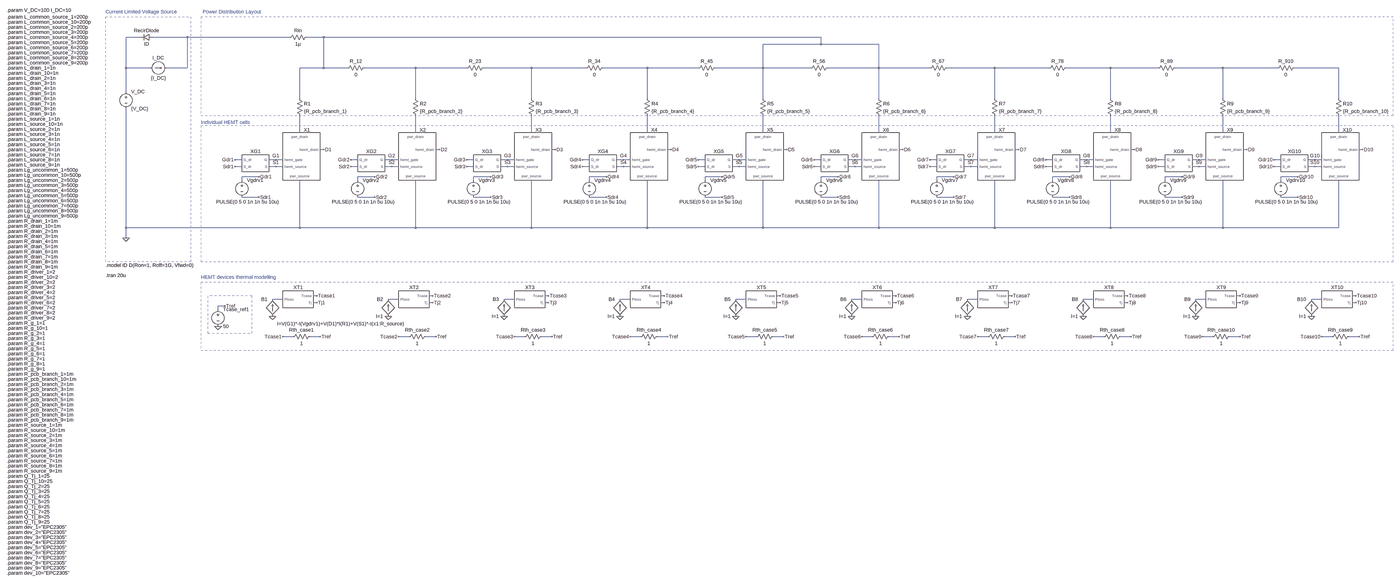
[diagram p0: schematic ParGan_V4.asc, whole sheet]
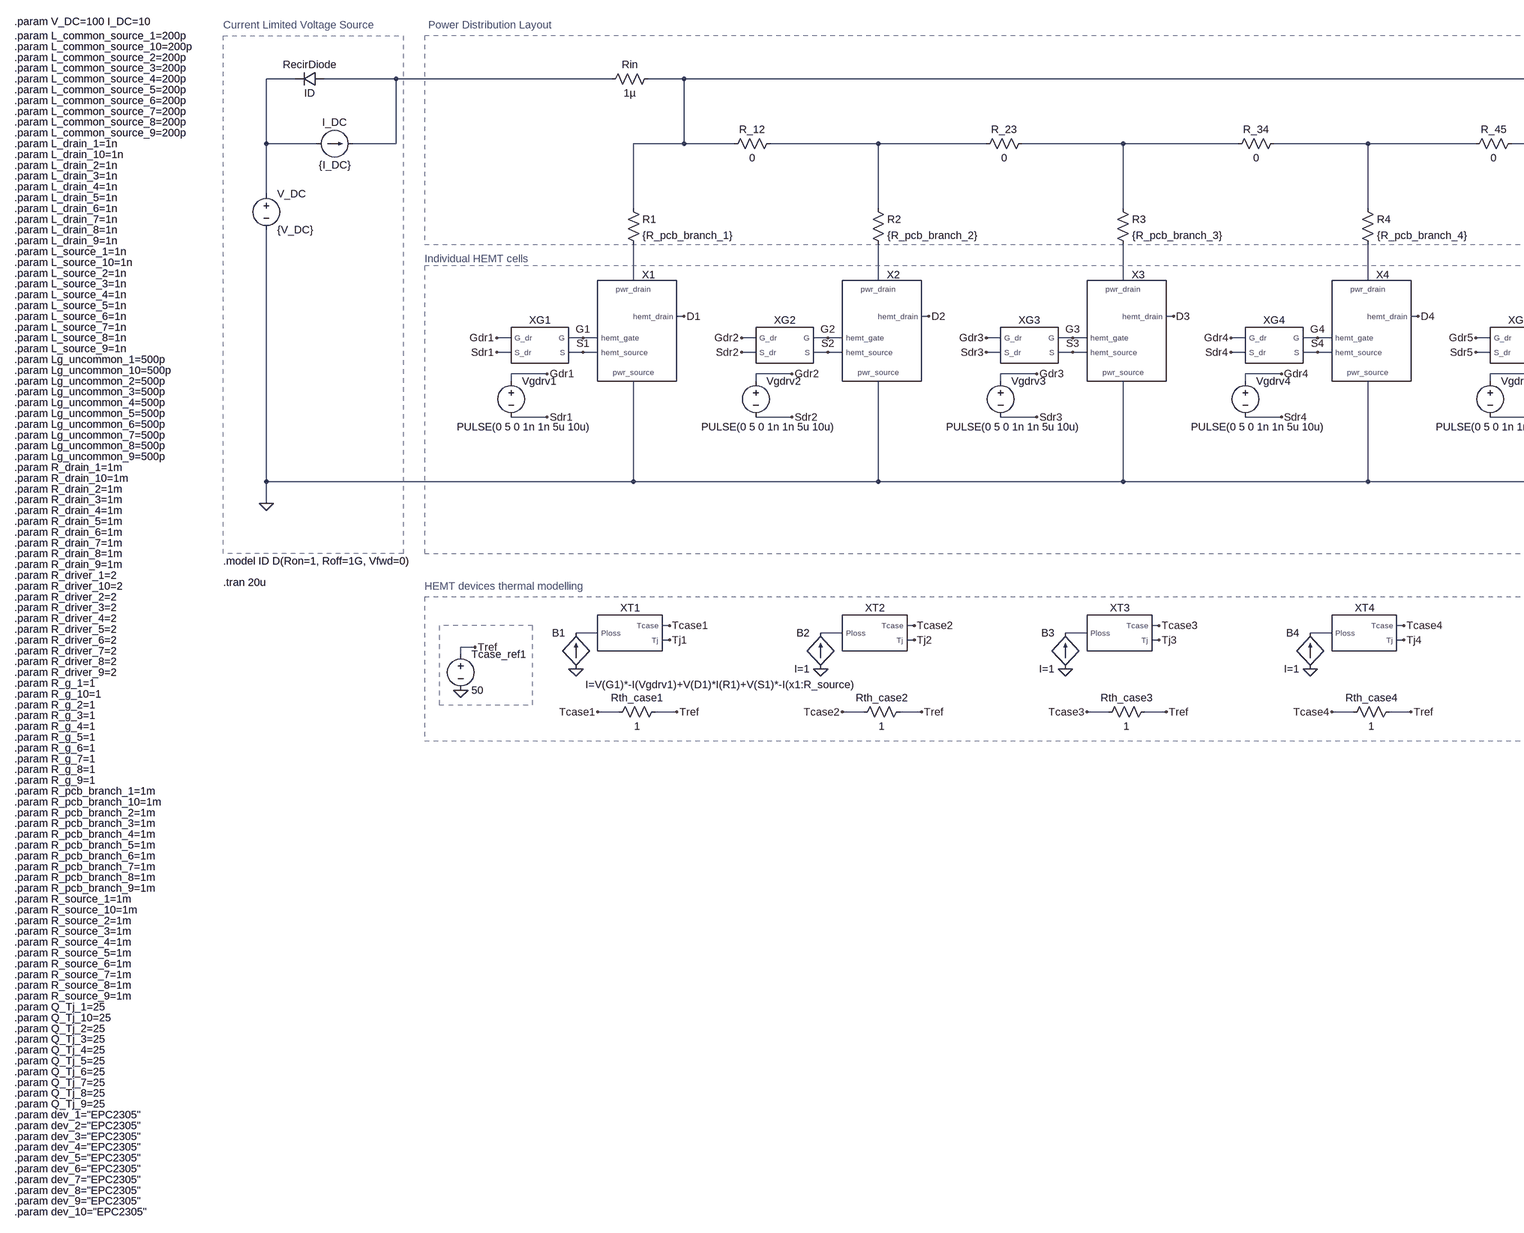
[diagram p1: schematic ParGan_V4.asc, part, row 1 of 1, column 1 of 2]
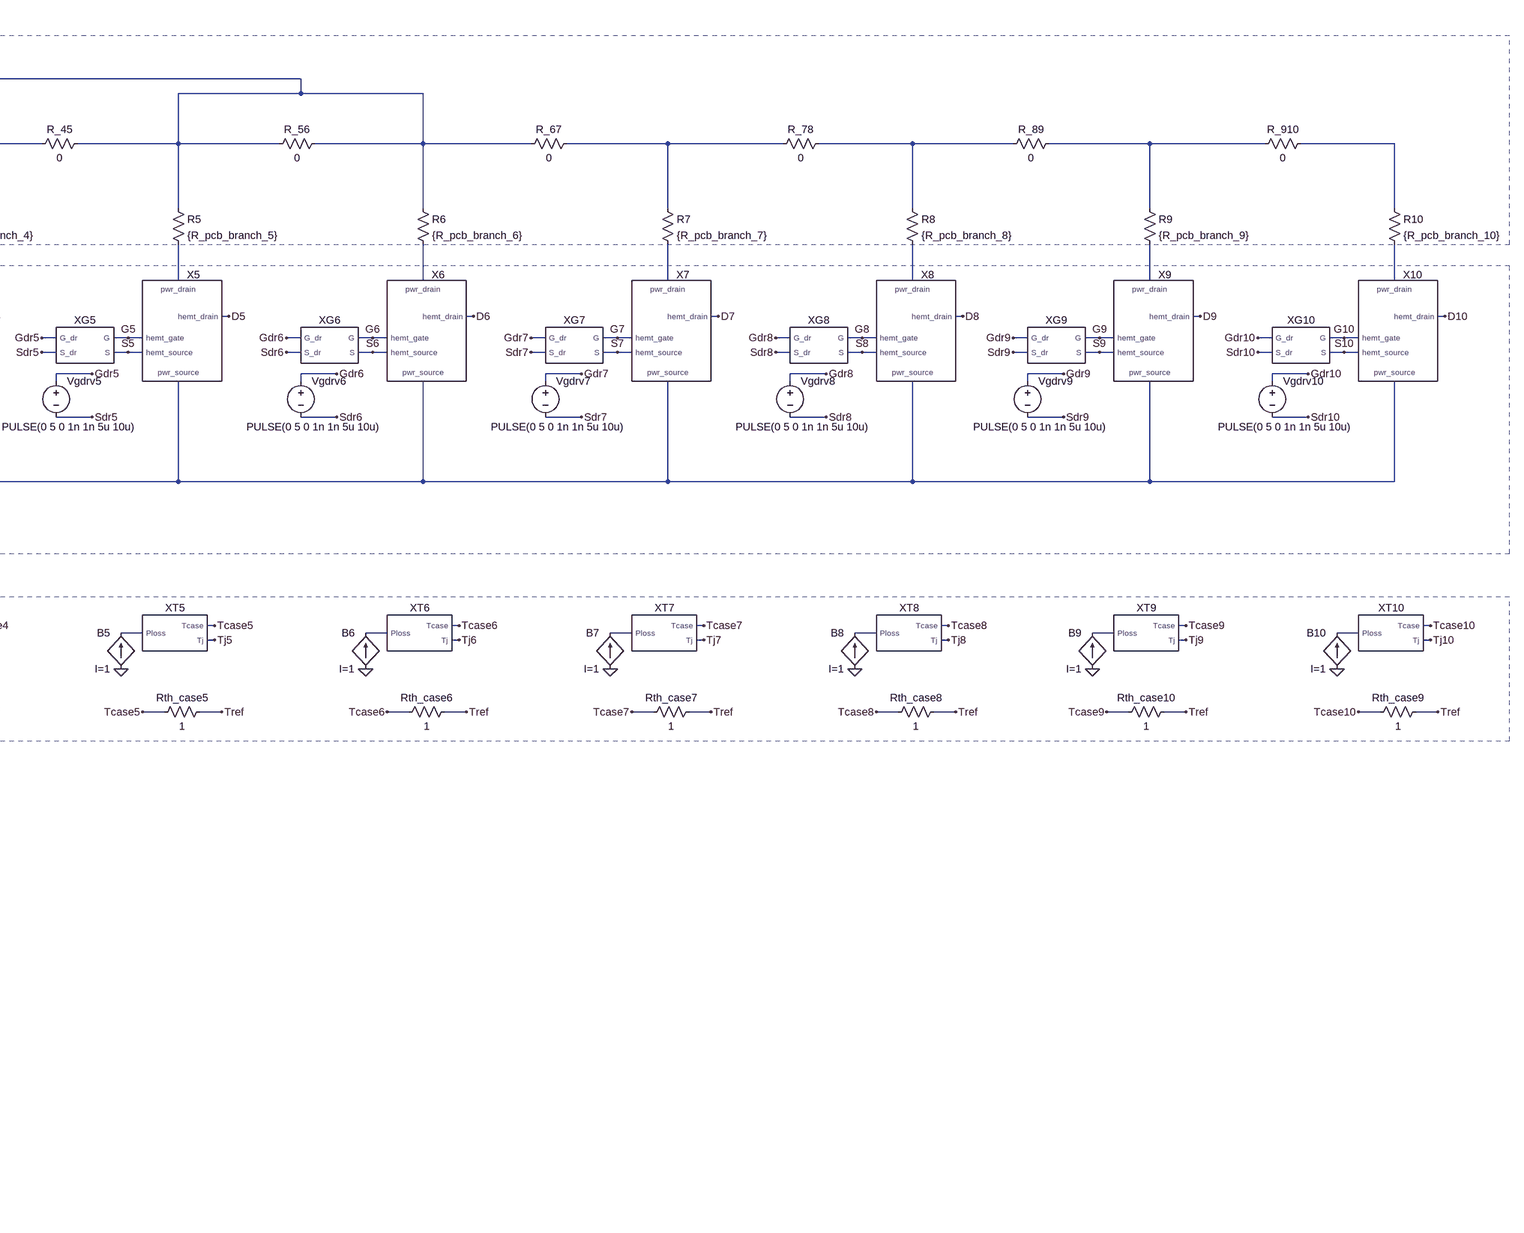
[diagram p2: schematic ParGan_V4.asc, part, row 1 of 1, column 2 of 2]
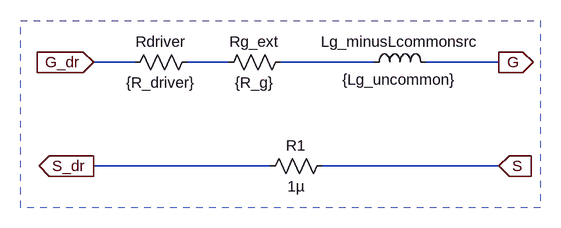
[diagram p3: sub-circuit gate_cell_v1.asc]
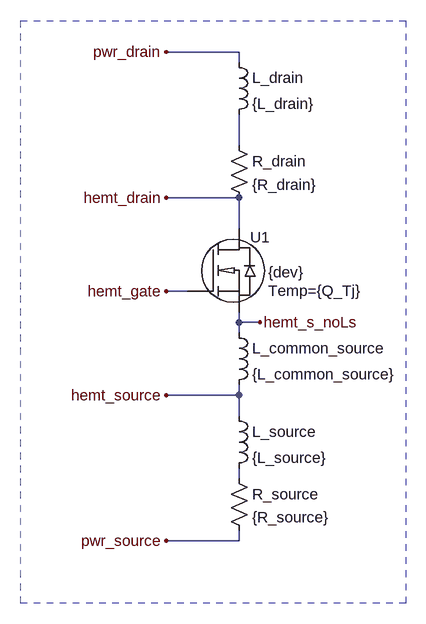
[diagram p4: sub-circuit hemt_cell_v2.asc]
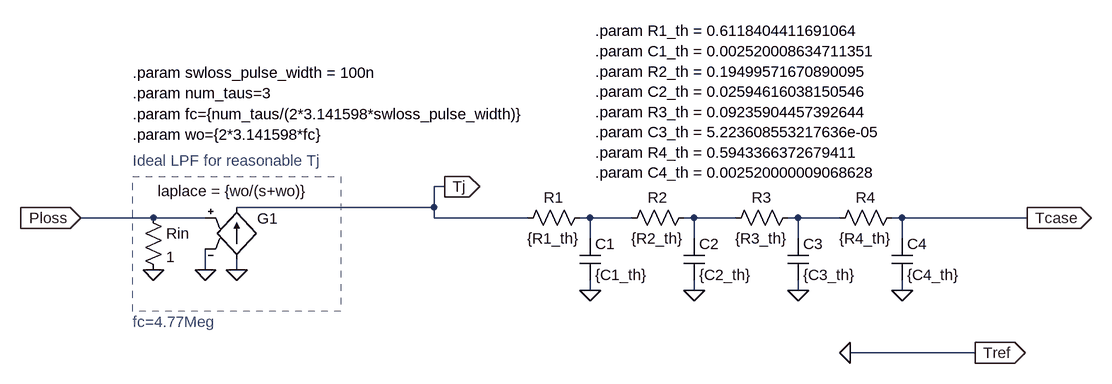
[diagram p5: sub-circuit thermalnetwork_epc2305.asc]
ParGan_V4.asc, the LTspice schematic file:
Version 4.1
SHEET 1 8596 3280
WIRE -416 -464 -480 -464
WIRE -192 -464 -352 -464
WIRE 288 -464 -192 -464
WIRE 448 -464 368 -464
WIRE 2784 -464 448 -464
WIRE 2784 -432 2784 -464
WIRE 2784 -432 2512 -432
WIRE 3056 -432 2784 -432
WIRE -480 -320 -480 -464
WIRE -368 -320 -480 -320
WIRE -192 -320 -192 -464
WIRE -192 -320 -288 -320
WIRE 448 -320 448 -464
WIRE 448 -320 336 -320
WIRE 560 -320 448 -320
WIRE 880 -320 640 -320
WIRE 1120 -320 880 -320
WIRE 1424 -320 1200 -320
WIRE 1680 -320 1424 -320
WIRE 1968 -320 1760 -320
WIRE 2208 -320 1968 -320
WIRE 2512 -320 2512 -432
WIRE 2512 -320 2288 -320
WIRE 2736 -320 2512 -320
WIRE 3056 -320 3056 -432
WIRE 3056 -320 2816 -320
WIRE 3296 -320 3056 -320
WIRE 3600 -320 3376 -320
WIRE 3856 -320 3600 -320
WIRE 4144 -320 3936 -320
WIRE 4368 -320 4144 -320
WIRE 4672 -320 4448 -320
WIRE 4928 -320 4672 -320
WIRE 5216 -320 5008 -320
WIRE -480 -208 -480 -320
WIRE 336 -176 336 -320
WIRE 880 -176 880 -320
WIRE 1424 -176 1424 -320
WIRE 1968 -176 1968 -320
WIRE 2512 -176 2512 -320
WIRE 3056 -176 3056 -320
WIRE 3600 -176 3600 -320
WIRE 4144 -176 4144 -320
WIRE 4672 -176 4672 -320
WIRE 5216 -176 5216 -320
WIRE 336 -16 336 -96
WIRE 880 -16 880 -96
WIRE 1424 -16 1424 -96
WIRE 1968 -16 1968 -96
WIRE 2512 -16 2512 -96
WIRE 3056 -16 3056 -96
WIRE 3600 -16 3600 -96
WIRE 4144 -16 4144 -96
WIRE 4672 -16 4672 -96
WIRE 5216 -16 5216 -96
WIRE 448 64 432 64
WIRE 992 64 976 64
WIRE 1536 64 1520 64
WIRE 2080 64 2064 64
WIRE 2624 64 2608 64
WIRE 3168 64 3152 64
WIRE 3712 64 3696 64
WIRE 4256 64 4240 64
WIRE 4784 64 4768 64
WIRE 5328 64 5312 64
WIRE 64 112 32 112
WIRE 224 112 192 112
WIRE 256 112 224 112
WIRE 608 112 576 112
WIRE 768 112 736 112
WIRE 800 112 768 112
WIRE 1152 112 1120 112
WIRE 1312 112 1280 112
WIRE 1344 112 1312 112
WIRE 1696 112 1664 112
WIRE 1856 112 1824 112
WIRE 1888 112 1856 112
WIRE 2240 112 2208 112
WIRE 2400 112 2368 112
WIRE 2432 112 2400 112
WIRE 2784 112 2752 112
WIRE 2944 112 2912 112
WIRE 2976 112 2944 112
WIRE 3328 112 3296 112
WIRE 3488 112 3456 112
WIRE 3520 112 3488 112
WIRE 3872 112 3840 112
WIRE 4032 112 4000 112
WIRE 4064 112 4032 112
WIRE 4400 112 4368 112
WIRE 4560 112 4528 112
WIRE 4592 112 4560 112
WIRE 4944 112 4912 112
WIRE 5104 112 5072 112
WIRE 5136 112 5104 112
WIRE 64 144 32 144
WIRE 224 144 192 144
WIRE 256 144 224 144
WIRE 608 144 576 144
WIRE 768 144 736 144
WIRE 800 144 768 144
WIRE 1152 144 1120 144
WIRE 1312 144 1280 144
WIRE 1344 144 1312 144
WIRE 1696 144 1664 144
WIRE 1856 144 1824 144
WIRE 1888 144 1856 144
WIRE 2240 144 2208 144
WIRE 2400 144 2368 144
WIRE 2432 144 2400 144
WIRE 2784 144 2752 144
WIRE 2944 144 2912 144
WIRE 2976 144 2944 144
WIRE 3328 144 3296 144
WIRE 3488 144 3456 144
WIRE 3520 144 3488 144
WIRE 3872 144 3840 144
WIRE 4032 144 4000 144
WIRE 4064 144 4032 144
WIRE 4400 144 4368 144
WIRE 4560 144 4528 144
WIRE 4592 144 4560 144
WIRE 4944 144 4912 144
WIRE 5104 144 5072 144
WIRE 5136 144 5104 144
WIRE 144 192 64 192
WIRE 688 192 608 192
WIRE 1232 192 1152 192
WIRE 1776 192 1696 192
WIRE 2320 192 2240 192
WIRE 2864 192 2784 192
WIRE 3408 192 3328 192
WIRE 3952 192 3872 192
WIRE 4480 192 4400 192
WIRE 5024 192 4944 192
WIRE 64 208 64 192
WIRE 608 208 608 192
WIRE 1152 208 1152 192
WIRE 1696 208 1696 192
WIRE 2240 208 2240 192
WIRE 2784 208 2784 192
WIRE 3328 208 3328 192
WIRE 3872 208 3872 192
WIRE 4400 208 4400 192
WIRE 4944 208 4944 192
WIRE 144 288 64 288
WIRE 688 288 608 288
WIRE 1232 288 1152 288
WIRE 1776 288 1696 288
WIRE 2320 288 2240 288
WIRE 2864 288 2784 288
WIRE 3408 288 3328 288
WIRE 3952 288 3872 288
WIRE 4480 288 4400 288
WIRE 5024 288 4944 288
WIRE -480 432 -480 -128
WIRE 336 432 336 208
WIRE 336 432 -480 432
WIRE 880 432 880 208
WIRE 880 432 336 432
WIRE 1424 432 1424 208
WIRE 1424 432 880 432
WIRE 1968 432 1968 208
WIRE 1968 432 1424 432
WIRE 2512 432 2512 208
WIRE 2512 432 1968 432
WIRE 3056 432 3056 208
WIRE 3056 432 2512 432
WIRE 3600 432 3600 208
WIRE 3600 432 3056 432
WIRE 4144 432 4144 208
WIRE 4144 432 3600 432
WIRE 4672 432 4672 208
WIRE 4672 432 4144 432
WIRE 5216 432 5216 208
WIRE 5216 432 4672 432
WIRE -480 480 -480 432
WIRE 416 752 400 752
WIRE 960 752 944 752
WIRE 1504 752 1488 752
WIRE 2048 752 2032 752
WIRE 2592 752 2576 752
WIRE 3136 752 3120 752
WIRE 3680 752 3664 752
WIRE 4224 752 4208 752
WIRE 4752 752 4736 752
WIRE 5296 752 5280 752
WIRE 256 768 208 768
WIRE 800 768 752 768
WIRE 1344 768 1296 768
WIRE 1888 768 1840 768
WIRE 2432 768 2384 768
WIRE 2976 768 2928 768
WIRE 3520 768 3472 768
WIRE 4064 768 4016 768
WIRE 4592 768 4544 768
WIRE 5136 768 5088 768
WIRE 416 784 400 784
WIRE 960 784 944 784
WIRE 1504 784 1488 784
WIRE 2048 784 2032 784
WIRE 2592 784 2576 784
WIRE 3136 784 3120 784
WIRE 3680 784 3664 784
WIRE 4224 784 4208 784
WIRE 4752 784 4736 784
WIRE 5296 784 5280 784
WIRE -16 800 -48 800
WIRE -48 816 -48 800
WIRE 304 944 256 944
WIRE 432 944 384 944
WIRE 848 944 800 944
WIRE 976 944 928 944
WIRE 1392 944 1344 944
WIRE 1520 944 1472 944
WIRE 1936 944 1888 944
WIRE 2064 944 2016 944
WIRE 2480 944 2432 944
WIRE 2608 944 2560 944
WIRE 3024 944 2976 944
WIRE 3152 944 3104 944
WIRE 3568 944 3520 944
WIRE 3696 944 3648 944
WIRE 4112 944 4064 944
WIRE 4240 944 4192 944
WIRE 4624 944 4576 944
WIRE 4752 944 4704 944
WIRE 5184 944 5136 944
WIRE 5312 944 5264 944
FLAG -480 480 0
FLAG 448 64 D1
FLAG 224 112 G1
FLAG 224 144 S1
FLAG 32 112 Gdr1
FLAG 32 144 Sdr1
FLAG 144 192 Gdr1
FLAG 144 288 Sdr1
FLAG 992 64 D2
FLAG 768 112 G2
FLAG 768 144 S2
FLAG 576 112 Gdr2
FLAG 576 144 Sdr2
FLAG 688 192 Gdr2
FLAG 688 288 Sdr2
FLAG 1536 64 D3
FLAG 1312 112 G3
FLAG 1312 144 S3
FLAG 1120 112 Gdr3
FLAG 1120 144 Sdr3
FLAG 1232 192 Gdr3
FLAG 1232 288 Sdr3
FLAG 2080 64 D4
FLAG 1856 112 G4
FLAG 1856 144 S4
FLAG 1664 112 Gdr4
FLAG 1664 144 Sdr4
FLAG 1776 192 Gdr4
FLAG 1776 288 Sdr4
FLAG 2624 64 D5
FLAG 2400 112 G5
FLAG 2400 144 S5
FLAG 2208 112 Gdr5
FLAG 2208 144 Sdr5
FLAG 3168 64 D6
FLAG 2944 112 G6
FLAG 2944 144 S6
FLAG 2752 112 Gdr6
FLAG 2752 144 Sdr6
FLAG 3712 64 D7
FLAG 3488 112 G7
FLAG 3488 144 S7
FLAG 3296 112 Gdr7
FLAG 3296 144 Sdr7
FLAG 4256 64 D8
FLAG 4032 112 G8
FLAG 4032 144 S8
FLAG 3840 112 Gdr8
FLAG 3840 144 Sdr8
FLAG 4784 64 D9
FLAG 4560 112 G9
FLAG 4560 144 S9
FLAG 4368 112 Gdr9
FLAG 4368 144 Sdr9
FLAG 5328 64 D10
FLAG 5104 112 G10
FLAG 5104 144 S10
FLAG 4912 112 Gdr10
FLAG 4912 144 Sdr10
FLAG 5024 192 Gdr10
FLAG 5024 288 Sdr10
FLAG 4480 192 Gdr9
FLAG 4480 288 Sdr9
FLAG 3952 192 Gdr8
FLAG 3952 288 Sdr8
FLAG 3408 192 Gdr7
FLAG 3408 288 Sdr7
FLAG 2320 192 Gdr5
FLAG 2320 288 Sdr5
FLAG 2864 192 Gdr6
FLAG 2864 288 Sdr6
FLAG 416 784 Tj1
FLAG 416 752 Tcase1
FLAG 208 848 0
FLAG 960 784 Tj2
FLAG 960 752 Tcase2
FLAG 752 848 0
FLAG 1504 784 Tj3
FLAG 1504 752 Tcase3
FLAG 1296 848 0
FLAG 2048 784 Tj4
FLAG 2048 752 Tcase4
FLAG 1840 848 0
FLAG 2592 784 Tj5
FLAG 2592 752 Tcase5
FLAG 2384 848 0
FLAG 3136 784 Tj6
FLAG 3136 752 Tcase6
FLAG 2928 848 0
FLAG 3680 784 Tj7
FLAG 3680 752 Tcase7
FLAG 3472 848 0
FLAG 4224 784 Tj8
FLAG 4224 752 Tcase8
FLAG 4016 848 0
FLAG 4752 784 Tj9
FLAG 4752 752 Tcase9
FLAG 4544 848 0
FLAG 5296 784 Tj10
FLAG 5296 752 Tcase10
FLAG 5088 848 0
FLAG -48 896 0
FLAG -16 800 Tref
FLAG 256 944 Tcase1
FLAG 432 944 Tref
FLAG 800 944 Tcase2
FLAG 976 944 Tref
FLAG 1344 944 Tcase3
FLAG 1520 944 Tref
FLAG 1888 944 Tcase4
FLAG 2064 944 Tref
FLAG 2432 944 Tcase5
FLAG 2608 944 Tref
FLAG 2976 944 Tcase6
FLAG 3152 944 Tref
FLAG 3520 944 Tcase7
FLAG 3696 944 Tref
FLAG 4064 944 Tcase8
FLAG 4240 944 Tref
FLAG 5136 944 Tcase10
FLAG 5312 944 Tref
FLAG 4576 944 Tcase9
FLAG 4752 944 Tref
SYMBOL voltage -480 -224 R0
WINDOW 123 0 0 Left 0
WINDOW 39 0 0 Left 0
SYMATTR InstName V_DC
SYMATTR Value {V_DC}
SYMBOL voltage 64 192 R0
WINDOW 123 0 0 Left 0
WINDOW 39 0 0 Left 0
WINDOW 3 -121 118 Left 2
SYMATTR Value PULSE(0 5 0 1n 1n 5u 10u)
SYMATTR InstName Vgdrv1
SYMBOL gate_cell_V1 144 128 R0
SYMATTR InstName XG1
SYMATTR SpiceLine Lg_uncommon={Lg_uncommon_1} R_driver={R_driver_1} R_g={R_g_1}
SYMBOL voltage 608 192 R0
WINDOW 123 0 0 Left 0
WINDOW 39 0 0 Left 0
WINDOW 3 -121 118 Left 2
SYMATTR Value PULSE(0 5 0 1n 1n 5u 10u)
SYMATTR InstName Vgdrv2
SYMBOL gate_cell_V1 688 128 R0
SYMATTR InstName XG2
SYMATTR SpiceLine Lg_uncommon={Lg_uncommon_2} R_driver={R_driver_2} R_g={R_g_2}
SYMBOL res 320 -192 R0
SYMATTR InstName R1
SYMATTR Value {R_pcb_branch_1}
SYMBOL current -368 -320 R270
WINDOW 0 32 40 VTop 2
WINDOW 3 -32 40 VBottom 2
WINDOW 123 0 0 Left 0
WINDOW 39 0 0 Left 0
SYMATTR InstName I_DC
SYMATTR Value {I_DC}
SYMBOL diode -352 -480 R90
WINDOW 0 0 32 VBottom 2
WINDOW 3 32 32 VTop 2
SYMATTR InstName RecirDiode
SYMATTR Value ID
SYMBOL res 864 -192 R0
SYMATTR InstName R2
SYMATTR Value {R_pcb_branch_2}
SYMBOL voltage 1152 192 R0
WINDOW 123 0 0 Left 0
WINDOW 39 0 0 Left 0
WINDOW 3 -121 118 Left 2
SYMATTR Value PULSE(0 5 0 1n 1n 5u 10u)
SYMATTR InstName Vgdrv3
SYMBOL gate_cell_V1 1232 128 R0
SYMATTR InstName XG3
SYMATTR SpiceLine Lg_uncommon={Lg_uncommon_3} R_driver={R_driver_3} R_g={R_g_3}
SYMBOL voltage 1696 192 R0
WINDOW 123 0 0 Left 0
WINDOW 39 0 0 Left 0
WINDOW 3 -121 118 Left 2
SYMATTR Value PULSE(0 5 0 1n 1n 5u 10u)
SYMATTR InstName Vgdrv4
SYMBOL gate_cell_V1 1776 128 R0
SYMATTR InstName XG4
SYMATTR SpiceLine Lg_uncommon={Lg_uncommon_4} R_driver={R_driver_4} R_g={R_g_4}
SYMBOL res 1408 -192 R0
SYMATTR InstName R3
SYMATTR Value {R_pcb_branch_3}
SYMBOL res 1952 -192 R0
SYMATTR InstName R4
SYMATTR Value {R_pcb_branch_4}
SYMBOL res 656 -336 R90
WINDOW 0 0 56 VBottom 2
WINDOW 3 32 56 VTop 2
SYMATTR InstName R_12
SYMATTR Value 0
SYMBOL res 1216 -336 R90
WINDOW 0 0 56 VBottom 2
WINDOW 3 32 56 VTop 2
SYMATTR InstName R_23
SYMATTR Value 0
SYMBOL res 1776 -336 R90
WINDOW 0 0 56 VBottom 2
WINDOW 3 32 56 VTop 2
SYMATTR InstName R_34
SYMATTR Value 0
SYMBOL res 384 -480 R90
WINDOW 0 0 56 VBottom 2
WINDOW 3 32 56 VTop 2
SYMATTR InstName Rin
SYMATTR Value 1µ
SYMBOL hemt_cell_V2 352 112 R0
SYMATTR InstName X1
SYMATTR SpiceLine R_drain={R_drain_1} L_drain={L_drain_1} R_source={R_source_1} L_source={L_source_1} L_common_source={L_common_source_1} dev={dev_1} Q_Tj={Q_Tj_1}
SYMBOL hemt_cell_V2 896 112 R0
SYMATTR InstName X2
SYMATTR SpiceLine R_drain={R_drain_2} L_drain={L_drain_2} R_source={R_source_2} L_source={L_source_2} L_common_source={L_common_source_2} dev={dev_2} Q_Tj={Q_Tj_2}
SYMBOL hemt_cell_V2 1440 112 R0
SYMATTR InstName X3
SYMATTR SpiceLine R_drain={R_drain_3} L_drain={L_drain_3} R_source={R_source_3} L_source={L_source_3} L_common_source={L_common_source_3} dev={dev_3} Q_Tj={Q_Tj_3}
SYMBOL hemt_cell_V2 1984 112 R0
SYMATTR InstName X4
SYMATTR SpiceLine R_drain={R_drain_4} L_drain={L_drain_4} R_source={R_source_4} L_source={L_source_4} L_common_source={L_common_source_4} dev={dev_4} Q_Tj={Q_Tj_4}
SYMBOL voltage 2240 192 R0
WINDOW 123 0 0 Left 0
WINDOW 39 0 0 Left 0
WINDOW 3 -121 118 Left 2
SYMATTR Value PULSE(0 5 0 1n 1n 5u 10u)
SYMATTR InstName Vgdrv5
SYMBOL gate_cell_V1 2320 128 R0
SYMATTR InstName XG5
SYMATTR SpiceLine Lg_uncommon={Lg_uncommon_5} R_driver={R_driver_5} R_g={R_g_5}
SYMBOL voltage 2784 192 R0
WINDOW 123 0 0 Left 0
WINDOW 39 0 0 Left 0
WINDOW 3 -121 118 Left 2
SYMATTR Value PULSE(0 5 0 1n 1n 5u 10u)
SYMATTR InstName Vgdrv6
SYMBOL gate_cell_V1 2864 128 R0
SYMATTR InstName XG6
SYMATTR SpiceLine Lg_uncommon={Lg_uncommon_6} R_driver={R_driver_6} R_g={R_g_6}
SYMBOL res 2496 -192 R0
SYMATTR InstName R5
SYMATTR Value {R_pcb_branch_5}
SYMBOL res 3040 -192 R0
SYMATTR InstName R6
SYMATTR Value {R_pcb_branch_6}
SYMBOL voltage 3328 192 R0
WINDOW 123 0 0 Left 0
WINDOW 39 0 0 Left 0
WINDOW 3 -121 118 Left 2
SYMATTR Value PULSE(0 5 0 1n 1n 5u 10u)
SYMATTR InstName Vgdrv7
SYMBOL gate_cell_V1 3408 128 R0
SYMATTR InstName XG7
SYMATTR SpiceLine Lg_uncommon={Lg_uncommon_7} R_driver={R_driver_7} R_g={R_g_7}
SYMBOL voltage 3872 192 R0
WINDOW 123 0 0 Left 0
WINDOW 39 0 0 Left 0
WINDOW 3 -121 118 Left 2
SYMATTR Value PULSE(0 5 0 1n 1n 5u 10u)
SYMATTR InstName Vgdrv8
SYMBOL gate_cell_V1 3952 128 R0
SYMATTR InstName XG8
SYMATTR SpiceLine Lg_uncommon={Lg_uncommon_8} R_driver={R_driver_8} R_g={R_g_8}
SYMBOL res 3584 -192 R0
SYMATTR InstName R7
SYMATTR Value {R_pcb_branch_7}
SYMBOL res 4128 -192 R0
SYMATTR InstName R8
SYMATTR Value {R_pcb_branch_8}
SYMBOL res 2832 -336 R90
WINDOW 0 0 56 VBottom 2
WINDOW 3 32 56 VTop 2
SYMATTR InstName R_56
SYMATTR Value 0
SYMBOL res 3392 -336 R90
WINDOW 0 0 56 VBottom 2
WINDOW 3 32 56 VTop 2
SYMATTR InstName R_67
SYMATTR Value 0
SYMBOL res 3952 -336 R90
WINDOW 0 0 56 VBottom 2
WINDOW 3 32 56 VTop 2
SYMATTR InstName R_78
SYMATTR Value 0
SYMBOL hemt_cell_V2 2528 112 R0
SYMATTR InstName X5
SYMATTR SpiceLine R_drain={R_drain_5} L_drain={L_drain_5} R_source={R_source_5} L_source={L_source_5} L_common_source={L_common_source_5} dev={dev_5} Q_Tj={Q_Tj_5}
SYMBOL hemt_cell_V2 3072 112 R0
SYMATTR InstName X6
SYMATTR SpiceLine R_drain={R_drain_6} L_drain={L_drain_6} R_source={R_source_6} L_source={L_source_6} L_common_source={L_common_source_6} dev={dev_6} Q_Tj={Q_Tj_6}
SYMBOL hemt_cell_V2 3616 112 R0
SYMATTR InstName X7
SYMATTR SpiceLine R_drain={R_drain_7} L_drain={L_drain_7} R_source={R_source_7} L_source={L_source_7} L_common_source={L_common_source_7} dev={dev_7} Q_Tj={Q_Tj_7}
SYMBOL hemt_cell_V2 4160 112 R0
SYMATTR InstName X8
SYMATTR SpiceLine R_drain={R_drain_8} L_drain={L_drain_8} R_source={R_source_8} L_source={L_source_8} L_common_source={L_common_source_8} dev={dev_8} Q_Tj={Q_Tj_8}
SYMBOL voltage 4400 192 R0
WINDOW 123 0 0 Left 0
WINDOW 39 0 0 Left 0
WINDOW 3 -121 118 Left 2
SYMATTR Value PULSE(0 5 0 1n 1n 5u 10u)
SYMATTR InstName Vgdrv9
SYMBOL gate_cell_V1 4480 128 R0
SYMATTR InstName XG9
SYMATTR SpiceLine Lg_uncommon={Lg_uncommon_9} R_driver={R_driver_9} R_g={R_g_9}
SYMBOL voltage 4944 192 R0
WINDOW 123 0 0 Left 0
WINDOW 39 0 0 Left 0
WINDOW 3 -121 118 Left 2
SYMATTR Value PULSE(0 5 0 1n 1n 5u 10u)
SYMATTR InstName Vgdrv10
SYMBOL gate_cell_V1 5024 128 R0
SYMATTR InstName XG10
SYMATTR SpiceLine Lg_uncommon={Lg_uncommon_10} R_driver={R_driver_10} R_g={R_g_10}
SYMBOL res 4656 -192 R0
SYMATTR InstName R9
SYMATTR Value {R_pcb_branch_9}
SYMBOL res 5200 -192 R0
SYMATTR InstName R10
SYMATTR Value {R_pcb_branch_10}
SYMBOL res 4464 -336 R90
WINDOW 0 0 56 VBottom 2
WINDOW 3 32 56 VTop 2
SYMATTR InstName R_89
SYMATTR Value 0
SYMBOL res 5024 -336 R90
WINDOW 0 0 56 VBottom 2
WINDOW 3 32 56 VTop 2
SYMATTR InstName R_910
SYMATTR Value 0
SYMBOL hemt_cell_V2 4688 112 R0
SYMATTR InstName X9
SYMATTR SpiceLine R_drain={R_drain_9} L_drain={L_drain_9} R_source={R_source_9} L_source={L_source_9} L_common_source={L_common_source_9} dev={dev_9} Q_Tj={Q_Tj_9}
SYMBOL hemt_cell_V2 5232 112 R0
SYMATTR InstName X10
SYMATTR SpiceLine R_drain={R_drain_10} L_drain={L_drain_10} R_source={R_source_10} L_source={L_source_10} L_common_source={L_common_source_10} dev={dev_10} Q_Tj={Q_Tj_10}
SYMBOL res 2304 -336 R90
WINDOW 0 0 56 VBottom 2
WINDOW 3 32 56 VTop 2
SYMATTR InstName R_45
SYMATTR Value 0
SYMBOL ThermalNetwork_EPC2305 304 768 R0
SYMATTR InstName XT1
SYMATTR SpiceLine Q_Tj={Q_Tj_1}
SYMBOL bi 208 848 R180
WINDOW 0 24 80 Left 2
WINDOW 3 -616 -35 Left 2
SYMATTR InstName B1
SYMATTR Value I=V(G1)*-I(Vgdrv1)+V(D1)*I(R1)+V(S1)*-I(x1:R_source)
SYMBOL ThermalNetwork_EPC2305 848 768 R0
SYMATTR InstName XT2
SYMATTR SpiceLine Q_Tj={Q_Tj_2}
SYMBOL bi 752 848 R180
WINDOW 0 24 80 Left 2
WINDOW 3 24 0 Left 2
SYMATTR InstName B2
SYMATTR Value I=1
SYMBOL ThermalNetwork_EPC2305 1392 768 R0
SYMATTR InstName XT3
SYMATTR SpiceLine Q_Tj={Q_Tj_3}
SYMBOL bi 1296 848 R180
WINDOW 0 24 80 Left 2
WINDOW 3 24 0 Left 2
SYMATTR InstName B3
SYMATTR Value I=1
SYMBOL ThermalNetwork_EPC2305 1936 768 R0
SYMATTR InstName XT4
SYMATTR SpiceLine Q_Tj={Q_Tj_4}
SYMBOL bi 1840 848 R180
WINDOW 0 24 80 Left 2
WINDOW 3 24 0 Left 2
SYMATTR InstName B4
SYMATTR Value I=1
SYMBOL ThermalNetwork_EPC2305 2480 768 R0
SYMATTR InstName XT5
SYMATTR SpiceLine Q_Tj={Q_Tj_5}
SYMBOL bi 2384 848 R180
WINDOW 0 24 80 Left 2
WINDOW 3 24 0 Left 2
SYMATTR InstName B5
SYMATTR Value I=1
SYMBOL ThermalNetwork_EPC2305 3024 768 R0
SYMATTR InstName XT6
SYMATTR SpiceLine Q_Tj={Q_Tj_6}
SYMBOL bi 2928 848 R180
WINDOW 0 24 80 Left 2
WINDOW 3 24 0 Left 2
SYMATTR InstName B6
SYMATTR Value I=1
SYMBOL ThermalNetwork_EPC2305 3568 768 R0
SYMATTR InstName XT7
SYMATTR SpiceLine Q_Tj={Q_Tj_7}
SYMBOL bi 3472 848 R180
WINDOW 0 24 80 Left 2
WINDOW 3 24 0 Left 2
SYMATTR InstName B7
SYMATTR Value I=1
SYMBOL ThermalNetwork_EPC2305 4112 768 R0
SYMATTR InstName XT8
SYMATTR SpiceLine Q_Tj={Q_Tj_8}
SYMBOL bi 4016 848 R180
WINDOW 0 24 80 Left 2
WINDOW 3 24 0 Left 2
SYMATTR InstName B8
SYMATTR Value I=1
SYMBOL ThermalNetwork_EPC2305 4640 768 R0
SYMATTR InstName XT9
SYMATTR SpiceLine Q_Tj={Q_Tj_9}
SYMBOL bi 4544 848 R180
WINDOW 0 24 80 Left 2
WINDOW 3 24 0 Left 2
SYMATTR InstName B9
SYMATTR Value I=1
SYMBOL ThermalNetwork_EPC2305 5184 768 R0
SYMATTR InstName XT10
SYMATTR SpiceLine Q_Tj={Q_Tj_10}
SYMBOL bi 5088 848 R180
WINDOW 0 24 80 Left 2
WINDOW 3 24 0 Left 2
SYMATTR InstName B10
SYMATTR Value I=1
SYMBOL voltage -48 800 R0
SYMATTR InstName Tcase_ref1
SYMATTR Value 50
SYMBOL res 400 928 R90
WINDOW 0 0 56 VBottom 2
WINDOW 3 32 56 VTop 2
SYMATTR InstName Rth_case1
SYMATTR Value 1
SYMBOL res 944 928 R90
WINDOW 0 0 56 VBottom 2
WINDOW 3 32 56 VTop 2
SYMATTR InstName Rth_case2
SYMATTR Value 1
SYMBOL res 1488 928 R90
WINDOW 0 0 56 VBottom 2
WINDOW 3 32 56 VTop 2
SYMATTR InstName Rth_case3
SYMATTR Value 1
SYMBOL res 2032 928 R90
WINDOW 0 0 56 VBottom 2
WINDOW 3 32 56 VTop 2
SYMATTR InstName Rth_case4
SYMATTR Value 1
SYMBOL res 2576 928 R90
WINDOW 0 0 56 VBottom 2
WINDOW 3 32 56 VTop 2
SYMATTR InstName Rth_case5
SYMATTR Value 1
SYMBOL res 3120 928 R90
WINDOW 0 0 56 VBottom 2
WINDOW 3 32 56 VTop 2
SYMATTR InstName Rth_case6
SYMATTR Value 1
SYMBOL res 3664 928 R90
WINDOW 0 0 56 VBottom 2
WINDOW 3 32 56 VTop 2
SYMATTR InstName Rth_case7
SYMATTR Value 1
SYMBOL res 4208 928 R90
WINDOW 0 0 56 VBottom 2
WINDOW 3 32 56 VTop 2
SYMATTR InstName Rth_case8
SYMATTR Value 1
SYMBOL res 5280 928 R90
WINDOW 0 0 56 VBottom 2
WINDOW 3 32 56 VTop 2
SYMATTR InstName Rth_case9
SYMATTR Value 1
SYMBOL res 4720 928 R90
WINDOW 0 0 56 VBottom 2
WINDOW 3 32 56 VTop 2
SYMATTR InstName Rth_case10
SYMATTR Value 1
TEXT -576 656 Left 2 !.tran 20u
TEXT -576 608 Left 2 !.model ID D(Ron=1, Roff=1G, Vfwd=0)
TEXT -576 -584 Left 2 ;Current Limited Voltage Source
TEXT -120 -584 Left 2 ;Power Distribution Layout
TEXT -128 -64 Left 2 ;Individual HEMT cells
TEXT -1040 -592 Left 2 !.param V_DC=100 I_DC=10
TEXT -1040 -560 Left 2 !.param L_common_source_1=200p
TEXT -1040 -536 Left 2 !.param L_common_source_10=200p
TEXT -1040 -512 Left 2 !.param L_common_source_2=200p
TEXT -1040 -488 Left 2 !.param L_common_source_3=200p
TEXT -1040 -464 Left 2 !.param L_common_source_4=200p
TEXT -1040 -440 Left 2 !.param L_common_source_5=200p
TEXT -1040 -416 Left 2 !.param L_common_source_6=200p
TEXT -1040 -392 Left 2 !.param L_common_source_7=200p
TEXT -1040 -368 Left 2 !.param L_common_source_8=200p
TEXT -1040 -344 Left 2 !.param L_common_source_9=200p
TEXT -1040 -320 Left 2 !.param L_drain_1=1n
TEXT -1040 -296 Left 2 !.param L_drain_10=1n
TEXT -1040 -272 Left 2 !.param L_drain_2=1n
TEXT -1040 -248 Left 2 !.param L_drain_3=1n
TEXT -1040 -224 Left 2 !.param L_drain_4=1n
TEXT -1040 -200 Left 2 !.param L_drain_5=1n
TEXT -1040 -176 Left 2 !.param L_drain_6=1n
TEXT -1040 -152 Left 2 !.param L_drain_7=1n
TEXT -1040 -128 Left 2 !.param L_drain_8=1n
TEXT -1040 -104 Left 2 !.param L_drain_9=1n
TEXT -1040 -80 Left 2 !.param L_source_1=1n
TEXT -1040 -56 Left 2 !.param L_source_10=1n
TEXT -1040 -32 Left 2 !.param L_source_2=1n
TEXT -1040 -8 Left 2 !.param L_source_3=1n
TEXT -1040 16 Left 2 !.param L_source_4=1n
TEXT -1040 40 Left 2 !.param L_source_5=1n
TEXT -1040 64 Left 2 !.param L_source_6=1n
TEXT -1040 88 Left 2 !.param L_source_7=1n
TEXT -1040 112 Left 2 !.param L_source_8=1n
TEXT -1040 136 Left 2 !.param L_source_9=1n
TEXT -1040 160 Left 2 !.param Lg_uncommon_1=500p
TEXT -1040 184 Left 2 !.param Lg_uncommon_10=500p
TEXT -1040 208 Left 2 !.param Lg_uncommon_2=500p
TEXT -1040 232 Left 2 !.param Lg_uncommon_3=500p
TEXT -1040 256 Left 2 !.param Lg_uncommon_4=500p
TEXT -1040 280 Left 2 !.param Lg_uncommon_5=500p
TEXT -1040 304 Left 2 !.param Lg_uncommon_6=500p
TEXT -1040 328 Left 2 !.param Lg_uncommon_7=500p
TEXT -1040 352 Left 2 !.param Lg_uncommon_8=500p
TEXT -1040 376 Left 2 !.param Lg_uncommon_9=500p
TEXT -1040 400 Left 2 !.param R_drain_1=1m
TEXT -1040 424 Left 2 !.param R_drain_10=1m
TEXT -1040 448 Left 2 !.param R_drain_2=1m
TEXT -1040 472 Left 2 !.param R_drain_3=1m
TEXT -1040 496 Left 2 !.param R_drain_4=1m
TEXT -1040 520 Left 2 !.param R_drain_5=1m
TEXT -1040 544 Left 2 !.param R_drain_6=1m
TEXT -1040 568 Left 2 !.param R_drain_7=1m
TEXT -1040 592 Left 2 !.param R_drain_8=1m
TEXT -1040 616 Left 2 !.param R_drain_9=1m
TEXT -1040 640 Left 2 !.param R_driver_1=2
TEXT -1040 664 Left 2 !.param R_driver_10=2
TEXT -1040 688 Left 2 !.param R_driver_2=2
TEXT -1040 712 Left 2 !.param R_driver_3=2
TEXT -1040 736 Left 2 !.param R_driver_4=2
TEXT -1040 760 Left 2 !.param R_driver_5=2
TEXT -1040 784 Left 2 !.param R_driver_6=2
TEXT -1040 808 Left 2 !.param R_driver_7=2
TEXT -1040 832 Left 2 !.param R_driver_8=2
TEXT -1040 856 Left 2 !.param R_driver_9=2
TEXT -1040 880 Left 2 !.param R_g_1=1
TEXT -1040 904 Left 2 !.param R_g_10=1
TEXT -1040 928 Left 2 !.param R_g_2=1
TEXT -1040 952 Left 2 !.param R_g_3=1
TEXT -1040 976 Left 2 !.param R_g_4=1
TEXT -1040 1000 Left 2 !.param R_g_5=1
TEXT -1040 1024 Left 2 !.param R_g_6=1
TEXT -1040 1048 Left 2 !.param R_g_7=1
TEXT -1040 1072 Left 2 !.param R_g_8=1
TEXT -1040 1096 Left 2 !.param R_g_9=1
TEXT -1040 1120 Left 2 !.param R_pcb_branch_1=1m
TEXT -1040 1144 Left 2 !.param R_pcb_branch_10=1m
TEXT -1040 1168 Left 2 !.param R_pcb_branch_2=1m
TEXT -1040 1192 Left 2 !.param R_pcb_branch_3=1m
TEXT -1040 1216 Left 2 !.param R_pcb_branch_4=1m
TEXT -1040 1240 Left 2 !.param R_pcb_branch_5=1m
TEXT -1040 1264 Left 2 !.param R_pcb_branch_6=1m
TEXT -1040 1288 Left 2 !.param R_pcb_branch_7=1m
TEXT -1040 1312 Left 2 !.param R_pcb_branch_8=1m
TEXT -1040 1336 Left 2 !.param R_pcb_branch_9=1m
TEXT -1040 1360 Left 2 !.param R_source_1=1m
TEXT -1040 1384 Left 2 !.param R_source_10=1m
TEXT -1040 1408 Left 2 !.param R_source_2=1m
TEXT -1040 1432 Left 2 !.param R_source_3=1m
TEXT -1040 1456 Left 2 !.param R_source_4=1m
TEXT -1040 1480 Left 2 !.param R_source_5=1m
TEXT -1040 1504 Left 2 !.param R_source_6=1m
TEXT -1040 1528 Left 2 !.param R_source_7=1m
TEXT -1040 1552 Left 2 !.param R_source_8=1m
TEXT -1040 1576 Left 2 !.param R_source_9=1m
TEXT -1040 1840 Left 2 !.param dev_1="EPC2305"
TEXT -1040 1864 Left 2 !.param dev_2="EPC2305"
TEXT -1040 1888 Left 2 !.param dev_3="EPC2305"
TEXT -1040 1912 Left 2 !.param dev_4="EPC2305"
TEXT -1040 1936 Left 2 !.param dev_5="EPC2305"
TEXT -1040 1960 Left 2 !.param dev_6="EPC2305"
TEXT -1040 1984 Left 2 !.param dev_7="EPC2305"
TEXT -1040 2008 Left 2 !.param dev_8="EPC2305"
TEXT -1040 2032 Left 2 !.param dev_9="EPC2305"
TEXT -1040 2056 Left 2 !.param dev_10="EPC2305"
TEXT -128 664 Left 2 ;HEMT devices thermal modelling
TEXT -1040 1600 Left 2 !.param Q_Tj_1=25
TEXT -1040 1624 Left 2 !.param Q_Tj_10=25
TEXT -1040 1648 Left 2 !.param Q_Tj_2=25
TEXT -1040 1672 Left 2 !.param Q_Tj_3=25
TEXT -1040 1696 Left 2 !.param Q_Tj_4=25
TEXT -1040 1720 Left 2 !.param Q_Tj_5=25
TEXT -1040 1744 Left 2 !.param Q_Tj_6=25
TEXT -1040 1768 Left 2 !.param Q_Tj_7=25
TEXT -1040 1792 Left 2 !.param Q_Tj_8=25
TEXT -1040 1816 Left 2 !.param Q_Tj_9=25
RECTANGLE Normal 5472 -560 -128 -96 3
RECTANGLE Normal 5472 -48 -128 592 3
RECTANGLE Normal -176 592 -576 -560 3
RECTANGLE Normal 5472 688 -128 1008 3
RECTANGLE Normal 112 752 -96 928 3

gate_cell_v1.asc, the sub-circuit schematic file:
Version 4.1
SHEET 1 880 788
WIRE -176 96 -240 96
WIRE -32 96 -96 96
WIRE 192 96 48 96
WIRE 384 96 272 96
WIRE 32 256 -240 256
WIRE 384 256 112 256
FLAG -240 96 G_dr
IOPIN -240 96 In
FLAG -240 256 S_dr
IOPIN -240 256 Out
FLAG 384 96 G
IOPIN 384 96 Out
FLAG 384 256 S
IOPIN 384 256 In
SYMBOL res 64 80 R90
WINDOW 0 0 56 VBottom 2
WINDOW 3 32 56 VTop 2
SYMATTR InstName Rg_ext
SYMATTR Value {R_g}
SYMBOL ind 176 112 R270
WINDOW 0 32 56 VTop 2
WINDOW 3 5 56 VBottom 2
SYMATTR InstName Lg_minusLcommonsrc
SYMATTR Value {Lg_uncommon}
SYMBOL res -80 80 R90
WINDOW 0 0 56 VBottom 2
WINDOW 3 32 56 VTop 2
SYMATTR InstName Rdriver
SYMATTR Value {R_driver}
SYMBOL res 128 240 R90
WINDOW 0 0 56 VBottom 2
WINDOW 3 32 56 VTop 2
SYMATTR InstName R1
SYMATTR Value 1µ
RECTANGLE Normal 448 320 -352 32 3

hemt_cell_v2.asc, the sub-circuit schematic file:
Version 4.1
SHEET 1 1704 680
WIRE 672 -352 560 -352
WIRE 672 -336 672 -352
WIRE 672 -208 672 -256
WIRE 672 -128 560 -128
WIRE 672 -80 672 -128
WIRE 592 16 560 16
WIRE 672 64 672 48
WIRE 704 64 672 64
WIRE 672 80 672 64
WIRE 672 176 672 160
WIRE 672 176 560 176
WIRE 672 208 672 176
WIRE 672 304 672 288
WIRE 672 400 672 384
WIRE 672 400 560 400
FLAG 560 176 hemt_source
FLAG 560 16 hemt_gate
FLAG 560 -128 hemt_drain
FLAG 560 -352 pwr_drain
FLAG 560 400 pwr_source
FLAG 704 64 hemt_s_noLs
SYMBOL res 656 -224 R0
SYMATTR InstName R_drain
SYMATTR Value {R_drain}
SYMBOL ind 656 -352 R0
SYMATTR InstName L_drain
SYMATTR Value {L_drain}
SYMBOL ind 656 192 R0
SYMATTR InstName L_source
SYMATTR Value {L_source}
SYMBOL res 656 288 R0
SYMATTR InstName R_source
SYMATTR Value {R_source}
SYMBOL ind 656 64 R0
SYMATTR InstName L_common_source
SYMATTR Value {L_common_source}
SYMBOL EPCGaN 592 16 R0
WINDOW 123 125 -1 Left 0
SYMATTR InstName U1
SYMATTR Value {dev}
SYMATTR Value2 Temp={Q_Tj}
RECTANGLE Normal 928 496 336 -400 3

thermalnetwork_epc2305.asc, the sub-circuit schematic file:
Version 4.1
SHEET 1 1260 680
WIRE 240 -32 224 -32
WIRE 224 0 224 -32
WIRE 224 0 -80 0
WIRE -208 16 -320 16
WIRE -128 16 -208 16
WIRE 224 16 224 0
WIRE 368 16 224 16
WIRE 464 16 448 16
WIRE 528 16 464 16
WIRE 624 16 608 16
WIRE 688 16 624 16
WIRE 784 16 768 16
WIRE 848 16 784 16
WIRE 944 16 928 16
WIRE 1136 16 944 16
WIRE 464 48 464 16
WIRE 624 48 624 16
WIRE 784 48 784 16
WIRE 944 48 944 16
WIRE -128 96 -128 64
WIRE -80 96 -80 80
WIRE 464 128 464 112
WIRE 624 128 624 112
WIRE 784 128 784 112
WIRE 944 128 944 112
WIRE 1056 224 864 224
FLAG 1136 16 Tcase
IOPIN 1136 16 Out
FLAG -320 16 Ploss
IOPIN -320 16 In
FLAG 464 128 0
FLAG 624 128 0
FLAG 784 128 0
FLAG 944 128 0
FLAG 240 -32 Tj
IOPIN 240 -32 Out
FLAG -208 96 0
FLAG -128 96 0
FLAG -80 96 0
FLAG 1056 224 Tref
IOPIN 1056 224 Out
FLAG 864 224 0
SYMBOL res 464 0 R90
WINDOW 0 0 56 VBottom 2
WINDOW 3 32 56 VTop 2
SYMATTR InstName R1
SYMATTR Value {R1_th}
SYMBOL cap 448 48 R0
SYMATTR InstName C1
SYMATTR Value {C1_th}
SYMBOL res 624 0 R90
WINDOW 0 0 56 VBottom 2
WINDOW 3 32 56 VTop 2
SYMATTR InstName R2
SYMATTR Value {R2_th}
SYMBOL cap 608 48 R0
SYMATTR InstName C2
SYMATTR Value {C2_th}
SYMBOL res 784 0 R90
WINDOW 0 0 56 VBottom 2
WINDOW 3 32 56 VTop 2
SYMATTR InstName R3
SYMATTR Value {R3_th}
SYMBOL cap 768 48 R0
SYMATTR InstName C3
SYMATTR Value {C3_th}
SYMBOL res 944 0 R90
WINDOW 0 0 56 VBottom 2
WINDOW 3 32 56 VTop 2
SYMATTR InstName R4
SYMATTR Value {R4_th}
SYMBOL cap 928 48 R0
SYMATTR InstName C4
SYMATTR Value {C4_th}
SYMBOL res -224 0 R0
SYMATTR InstName Rin
SYMATTR Value 1
SYMBOL g -80 -16 R0
WINDOW 0 32 33 Left 2
WINDOW 3 -121 -9 Left 2
SYMATTR InstName G1
SYMATTR Value laplace = {wo/(s+wo)}
TEXT 472 -272 Left 2 !.param R1_th = 0.6118404411691064\n.param C1_th = 0.002520008634711351\n.param R2_th = 0.19499571670890095\n.param C2_th = 0.02594616038150546\n.param R3_th = 0.09235904457392644\n.param C3_th = 5.223608553217636e-05\n.param R4_th = 0.5943366372679411\n.param C4_th = 0.002520000009068628
TEXT -240 176 Left 2 ;fc=4.77Meg
TEXT -240 -72 Left 2 ;Ideal LPF for reasonable Tj
TEXT -240 -112 Left 2 !.param wo={2*3.141598*fc}
TEXT -240 -208 Left 2 !.param swloss_pulse_width = 100n
TEXT -240 -144 Left 2 !.param fc={num_taus/(2*3.141598*swloss_pulse_width)}
TEXT -240 -176 Left 2 !.param num_taus=3
RECTANGLE Normal 80 160 -240 -48 2

The netlist it stands for:
* ParGan_V4.asc
V_DC N001 0 {V_DC}
Vgdrv1 Gdr1 Sdr1 PULSE(0 5 0 1n 1n 5u 10u)
X§XG1 Gdr1 S1 G1 Sdr1 gate_cell_v1 params: Lg_uncommon={Lg_uncommon_1} R_driver={R_driver_1} R_g={R_g_1}
Vgdrv2 Gdr2 Sdr2 PULSE(0 5 0 1n 1n 5u 10u)
X§XG2 Gdr2 S2 G2 Sdr2 gate_cell_v1 params: Lg_uncommon={Lg_uncommon_2} R_driver={R_driver_2} R_g={R_g_2}
R1 N003 N011 {R_pcb_branch_1}
I_DC N001 N002 {I_DC}
D§RecirDiode N002 N001 ID
R2 N004 N012 {R_pcb_branch_2}
Vgdrv3 Gdr3 Sdr3 PULSE(0 5 0 1n 1n 5u 10u)
X§XG3 Gdr3 S3 G3 Sdr3 gate_cell_v1 params: Lg_uncommon={Lg_uncommon_3} R_driver={R_driver_3} R_g={R_g_3}
Vgdrv4 Gdr4 Sdr4 PULSE(0 5 0 1n 1n 5u 10u)
X§XG4 Gdr4 S4 G4 Sdr4 gate_cell_v1 params: Lg_uncommon={Lg_uncommon_4} R_driver={R_driver_4} R_g={R_g_4}
R3 N005 N013 {R_pcb_branch_3}
R4 N006 N014 {R_pcb_branch_4}
R_12 N004 N003 0
R_23 N005 N004 0
R_34 N006 N005 0
Rin N003 N002 1µ
X§X1 D1 G1 S1 N011 0 hemt_cell_v2 params: R_drain={R_drain_1} L_drain={L_drain_1} R_source={R_source_1} L_source={L_source_1} L_common_source={L_common_source_1} dev={dev_1} Q_Tj={Q_Tj_1}
X§X2 D2 G2 S2 N012 0 hemt_cell_v2 params: R_drain={R_drain_2} L_drain={L_drain_2} R_source={R_source_2} L_source={L_source_2} L_common_source={L_common_source_2} dev={dev_2} Q_Tj={Q_Tj_2}
X§X3 D3 G3 S3 N013 0 hemt_cell_v2 params: R_drain={R_drain_3} L_drain={L_drain_3} R_source={R_source_3} L_source={L_source_3} L_common_source={L_common_source_3} dev={dev_3} Q_Tj={Q_Tj_3}
X§X4 D4 G4 S4 N014 0 hemt_cell_v2 params: R_drain={R_drain_4} L_drain={L_drain_4} R_source={R_source_4} L_source={L_source_4} L_common_source={L_common_source_4} dev={dev_4} Q_Tj={Q_Tj_4}
Vgdrv5 Gdr5 Sdr5 PULSE(0 5 0 1n 1n 5u 10u)
X§XG5 Gdr5 S5 G5 Sdr5 gate_cell_v1 params: Lg_uncommon={Lg_uncommon_5} R_driver={R_driver_5} R_g={R_g_5}
Vgdrv6 Gdr6 Sdr6 PULSE(0 5 0 1n 1n 5u 10u)
X§XG6 Gdr6 S6 G6 Sdr6 gate_cell_v1 params: Lg_uncommon={Lg_uncommon_6} R_driver={R_driver_6} R_g={R_g_6}
R5 N003 N015 {R_pcb_branch_5}
R6 N003 N016 {R_pcb_branch_6}
Vgdrv7 Gdr7 Sdr7 PULSE(0 5 0 1n 1n 5u 10u)
X§XG7 Gdr7 S7 G7 Sdr7 gate_cell_v1 params: Lg_uncommon={Lg_uncommon_7} R_driver={R_driver_7} R_g={R_g_7}
Vgdrv8 Gdr8 Sdr8 PULSE(0 5 0 1n 1n 5u 10u)
X§XG8 Gdr8 S8 G8 Sdr8 gate_cell_v1 params: Lg_uncommon={Lg_uncommon_8} R_driver={R_driver_8} R_g={R_g_8}
R7 N007 N017 {R_pcb_branch_7}
R8 N008 N018 {R_pcb_branch_8}
R_56 N003 N003 0
R_67 N007 N003 0
R_78 N008 N007 0
X§X5 D5 G5 S5 N015 0 hemt_cell_v2 params: R_drain={R_drain_5} L_drain={L_drain_5} R_source={R_source_5} L_source={L_source_5} L_common_source={L_common_source_5} dev={dev_5} Q_Tj={Q_Tj_5}
X§X6 D6 G6 S6 N016 0 hemt_cell_v2 params: R_drain={R_drain_6} L_drain={L_drain_6} R_source={R_source_6} L_source={L_source_6} L_common_source={L_common_source_6} dev={dev_6} Q_Tj={Q_Tj_6}
X§X7 D7 G7 S7 N017 0 hemt_cell_v2 params: R_drain={R_drain_7} L_drain={L_drain_7} R_source={R_source_7} L_source={L_source_7} L_common_source={L_common_source_7} dev={dev_7} Q_Tj={Q_Tj_7}
X§X8 D8 G8 S8 N018 0 hemt_cell_v2 params: R_drain={R_drain_8} L_drain={L_drain_8} R_source={R_source_8} L_source={L_source_8} L_common_source={L_common_source_8} dev={dev_8} Q_Tj={Q_Tj_8}
Vgdrv9 Gdr9 Sdr9 PULSE(0 5 0 1n 1n 5u 10u)
X§XG9 Gdr9 S9 G9 Sdr9 gate_cell_v1 params: Lg_uncommon={Lg_uncommon_9} R_driver={R_driver_9} R_g={R_g_9}
Vgdrv10 Gdr10 Sdr10 PULSE(0 5 0 1n 1n 5u 10u)
X§XG10 Gdr10 S10 G10 Sdr10 gate_cell_v1 params: Lg_uncommon={Lg_uncommon_10} R_driver={R_driver_10} R_g={R_g_10}
R9 N009 N019 {R_pcb_branch_9}
R10 N010 N020 {R_pcb_branch_10}
R_89 N009 N008 0
R_910 N010 N009 0
X§X9 D9 G9 S9 N019 0 hemt_cell_v2 params: R_drain={R_drain_9} L_drain={L_drain_9} R_source={R_source_9} L_source={L_source_9} L_common_source={L_common_source_9} dev={dev_9} Q_Tj={Q_Tj_9}
X§X10 D10 G10 S10 N020 0 hemt_cell_v2 params: R_drain={R_drain_10} L_drain={L_drain_10} R_source={R_source_10} L_source={L_source_10} L_common_source={L_common_source_10} dev={dev_10} Q_Tj={Q_Tj_10}
R_45 N003 N006 0
X§XT1 N021 Tcase1 Tj1 thermalnetwork_epc2305 params: Q_Tj={Q_Tj_1}
B1 0 N021 I=V(G1)*-I(Vgdrv1)+V(D1)*I(R1)+V(S1)*-I(x1:R_source)
X§XT2 N022 Tcase2 Tj2 thermalnetwork_epc2305 params: Q_Tj={Q_Tj_2}
B2 0 N022 I=1
X§XT3 N023 Tcase3 Tj3 thermalnetwork_epc2305 params: Q_Tj={Q_Tj_3}
B3 0 N023 I=1
X§XT4 N024 Tcase4 Tj4 thermalnetwork_epc2305 params: Q_Tj={Q_Tj_4}
B4 0 N024 I=1
X§XT5 N025 Tcase5 Tj5 thermalnetwork_epc2305 params: Q_Tj={Q_Tj_5}
B5 0 N025 I=1
X§XT6 N026 Tcase6 Tj6 thermalnetwork_epc2305 params: Q_Tj={Q_Tj_6}
B6 0 N026 I=1
X§XT7 N027 Tcase7 Tj7 thermalnetwork_epc2305 params: Q_Tj={Q_Tj_7}
B7 0 N027 I=1
X§XT8 N028 Tcase8 Tj8 thermalnetwork_epc2305 params: Q_Tj={Q_Tj_8}
B8 0 N028 I=1
X§XT9 N029 Tcase9 Tj9 thermalnetwork_epc2305 params: Q_Tj={Q_Tj_9}
B9 0 N029 I=1
X§XT10 N030 Tcase10 Tj10 thermalnetwork_epc2305 params: Q_Tj={Q_Tj_10}
B10 0 N030 I=1
V§Tcase_ref1 Tref 0 50
Rth_case1 Tref Tcase1 1
Rth_case2 Tref Tcase2 1
Rth_case3 Tref Tcase3 1
Rth_case4 Tref Tcase4 1
Rth_case5 Tref Tcase5 1
Rth_case6 Tref Tcase6 1
Rth_case7 Tref Tcase7 1
Rth_case8 Tref Tcase8 1
Rth_case9 Tref Tcase10 1
Rth_case10 Tref Tcase9 1

* block symbol definitions
.subckt gate_cell_v1 G_dr S G S_dr
Rg_ext N002 N001 {R_g}
Lg_minusLcommonsrc N002 G {Lg_uncommon}
Rdriver N001 G_dr {R_driver}
R1 S S_dr 1µ
.ends gate_cell_v1

.subckt hemt_cell_v2 hemt_drain hemt_gate hemt_source pwr_drain pwr_source
R_drain N001 hemt_drain {R_drain}
L_drain pwr_drain N001 {L_drain}
L_source hemt_source N002 {L_source}
R_source N002 pwr_source {R_source}
L_common_source hemt_s_noLs hemt_source {L_common_source}
X§U1 hemt_gate hemt_drain hemt_s_noLs {dev} Temp={Q_Tj}  ; pins gatein drainin sourcein
.ends hemt_cell_v2

.subckt thermalnetwork_epc2305 Ploss Tcase Tj
R1 N001 Tj {R1_th}
C1 N001 0 {C1_th}
R2 N002 N001 {R2_th}
C2 N002 0 {C2_th}
R3 N003 N002 {R3_th}
C3 N003 0 {C3_th}
R4 Tcase N003 {R4_th}
C4 Tcase 0 {C4_th}
Rin Ploss 0 1
G1 0 Tj Ploss 0 laplace = {wo/(s+wo)}
.param R1_th = 0.6118404411691064
.param C1_th = 0.002520008634711351
.param R2_th = 0.19499571670890095
.param C2_th = 0.02594616038150546
.param R3_th = 0.09235904457392644
.param C3_th = 5.223608553217636e-05
.param R4_th = 0.5943366372679411
.param C4_th = 0.002520000009068628
* fc=4.77Meg
* Ideal LPF for reasonable Tj
.param wo={2*3.141598*fc}
.param swloss_pulse_width = 100n
.param fc={num_taus/(2*3.141598*swloss_pulse_width)}
.param num_taus=3
.ends thermalnetwork_epc2305

.model D D
.lib standard.dio
.tran 20u
.model ID D(Ron=1, Roff=1G, Vfwd=0)
* Current Limited Voltage Source
* Power Distribution Layout
* Individual HEMT cells
.param V_DC=100 I_DC=10
.param L_common_source_1=200p
.param L_common_source_10=200p
.param L_common_source_2=200p
.param L_common_source_3=200p
.param L_common_source_4=200p
.param L_common_source_5=200p
.param L_common_source_6=200p
.param L_common_source_7=200p
.param L_common_source_8=200p
.param L_common_source_9=200p
.param L_drain_1=1n
.param L_drain_10=1n
.param L_drain_2=1n
.param L_drain_3=1n
.param L_drain_4=1n
.param L_drain_5=1n
.param L_drain_6=1n
.param L_drain_7=1n
.param L_drain_8=1n
.param L_drain_9=1n
.param L_source_1=1n
.param L_source_10=1n
.param L_source_2=1n
.param L_source_3=1n
.param L_source_4=1n
.param L_source_5=1n
.param L_source_6=1n
.param L_source_7=1n
.param L_source_8=1n
.param L_source_9=1n
.param Lg_uncommon_1=500p
.param Lg_uncommon_10=500p
.param Lg_uncommon_2=500p
.param Lg_uncommon_3=500p
.param Lg_uncommon_4=500p
.param Lg_uncommon_5=500p
.param Lg_uncommon_6=500p
.param Lg_uncommon_7=500p
.param Lg_uncommon_8=500p
.param Lg_uncommon_9=500p
.param R_drain_1=1m
.param R_drain_10=1m
.param R_drain_2=1m
.param R_drain_3=1m
.param R_drain_4=1m
.param R_drain_5=1m
.param R_drain_6=1m
.param R_drain_7=1m
.param R_drain_8=1m
.param R_drain_9=1m
.param R_driver_1=2
.param R_driver_10=2
.param R_driver_2=2
.param R_driver_3=2
.param R_driver_4=2
.param R_driver_5=2
.param R_driver_6=2
.param R_driver_7=2
.param R_driver_8=2
.param R_driver_9=2
.param R_g_1=1
.param R_g_10=1
.param R_g_2=1
.param R_g_3=1
.param R_g_4=1
.param R_g_5=1
.param R_g_6=1
.param R_g_7=1
.param R_g_8=1
.param R_g_9=1
.param R_pcb_branch_1=1m
.param R_pcb_branch_10=1m
.param R_pcb_branch_2=1m
.param R_pcb_branch_3=1m
.param R_pcb_branch_4=1m
.param R_pcb_branch_5=1m
.param R_pcb_branch_6=1m
.param R_pcb_branch_7=1m
.param R_pcb_branch_8=1m
.param R_pcb_branch_9=1m
.param R_source_1=1m
.param R_source_10=1m
.param R_source_2=1m
.param R_source_3=1m
.param R_source_4=1m
.param R_source_5=1m
.param R_source_6=1m
.param R_source_7=1m
.param R_source_8=1m
.param R_source_9=1m
.param dev_1="EPC2305"
.param dev_2="EPC2305"
.param dev_3="EPC2305"
.param dev_4="EPC2305"
.param dev_5="EPC2305"
.param dev_6="EPC2305"
.param dev_7="EPC2305"
.param dev_8="EPC2305"
.param dev_9="EPC2305"
.param dev_10="EPC2305"
* HEMT devices thermal modelling
.param Q_Tj_1=25
.param Q_Tj_10=25
.param Q_Tj_2=25
.param Q_Tj_3=25
.param Q_Tj_4=25
.param Q_Tj_5=25
.param Q_Tj_6=25
.param Q_Tj_7=25
.param Q_Tj_8=25
.param Q_Tj_9=25
.lib hemt_cell_V1
.lib EPCGanlibrary.lib
.backanno
.end